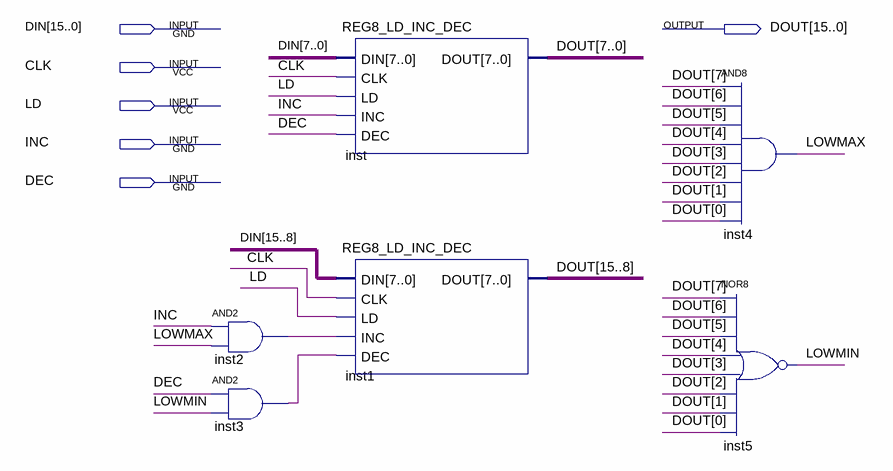
[diagram p0: schematic sheet]
// Quartus schematic REG16_LD_INC_DEC.bdf as structural Verilog: 6 symbols, 6 pins
module REG16_LD_INC_DEC (
  input  [15:0] DIN,
  input  CLK,
  input  LD,
  input  INC,
  input  DEC,
  output [15:0] DOUT
);

  wire inst2_out, inst3_out, LOWMAX, LOWMIN;

  and inst2 (inst2_out, INC, LOWMAX);
  and inst3 (inst3_out, DEC, LOWMIN);
  REG8_LD_INC_DEC inst (.DIN(DIN[7:0]), .CLK(CLK), .LD(LD), .INC(INC), .DEC(DEC), .DOUT(DOUT[7:0]));
  REG8_LD_INC_DEC inst1 (.DIN(DIN[15:8]), .CLK(CLK), .LD(LD), .INC(inst2_out), .DEC(inst3_out), .DOUT(DOUT[15:8]));
  and inst4 (LOWMAX, DOUT[7], DOUT[6], DOUT[5], DOUT[4], DOUT[3], DOUT[2], DOUT[1], DOUT[0]);
  nor inst5 (LOWMIN, DOUT[7], DOUT[6], DOUT[5], DOUT[4], DOUT[3], DOUT[2], DOUT[1], DOUT[0]);
endmodule
